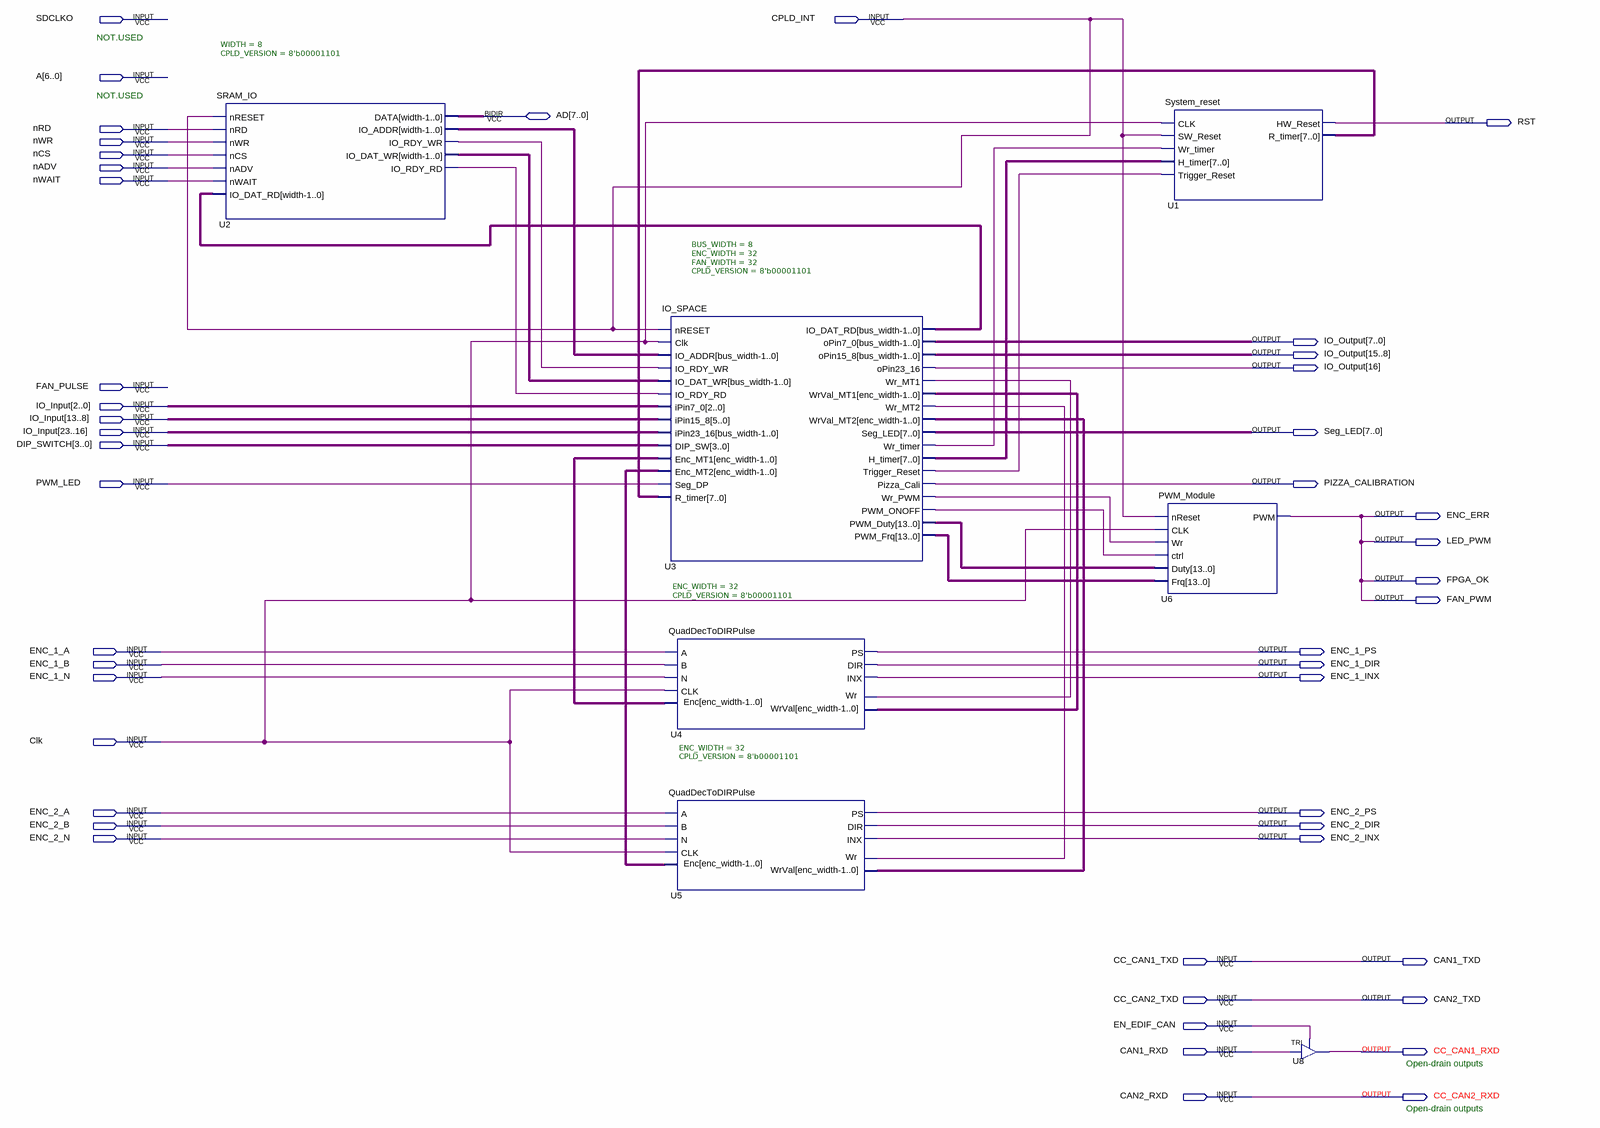
[diagram p0: schematic sheet]
// Quartus schematic MaterialTowerCPLD.bdf as structural Verilog: 7 symbols, 47 pins
module MaterialTowerCPLD (
  input  SDCLKO,
  input  CPLD_INT,
  input  [6:0] A,
  input  nRD,
  input  nWR,
  input  nCS,
  input  nADV,
  input  nWAIT,
  input  FAN_PULSE,
  input  [23:0] IO_Input,
  input  [3:0] DIP_SWITCH,
  input  PWM_LED,
  input  ENC_1_A,
  input  ENC_1_B,
  input  ENC_1_N,
  input  Clk,
  input  ENC_2_A,
  input  ENC_2_B,
  input  ENC_2_N,
  input  CC_CAN1_TXD,
  input  CC_CAN2_TXD,
  input  EN_EDIF_CAN,
  input  CAN1_RXD,
  input  CAN2_RXD,
  inout  [7:0] AD,
  output RST,
  output [16:0] IO_Output,
  output [7:0] Seg_LED,
  output PIZZA_CALIBRATION,
  output ENC_ERR,
  output LED_PWM,
  output FPGA_OK,
  output FAN_PWM,
  output ENC_1_PS,
  output ENC_1_DIR,
  output ENC_1_INX,
  output ENC_2_PS,
  output ENC_2_DIR,
  output ENC_2_INX,
  output CAN1_TXD,
  output CAN2_TXD,
  output CC_CAN1_RXD,
  output CC_CAN2_RXD
);

  wire U2_io_rdy_rd, U2_io_rdy_wr, U3_pwm_onoff, U3_trigger_reset, U3_wr_mt1, U3_wr_mt2, U3_wr_pwm,
       U3_wr_timer;
  wire [7:0] U1_r_timer, U2_io_addr, U2_io_dat_wr, U3_h_timer, U3_io_dat_rd;
  wire [13:0] U3_pwm_duty, U3_pwm_frq;
  wire [31:0] U3_wrval_mt1, U3_wrval_mt2, U4_enc, U5_enc;

  SRAM_IO #(.WIDTH(8), .CPLD_VERSION(8'b00001101)) U2 (
    .nRESET(CPLD_INT), .nRD(nRD), .nWR(nWR), .nCS(nCS), .nADV(nADV), .nWAIT(nWAIT), .IO_DAT_RD(U3_io_dat_rd),
    .IO_ADDR(U2_io_addr), .IO_RDY_WR(U2_io_rdy_wr), .IO_DAT_WR(U2_io_dat_wr), .IO_RDY_RD(U2_io_rdy_rd),
    .DATA(AD));
  IO_SPACE #(.BUS_WIDTH(8), .ENC_WIDTH(32), .FAN_WIDTH(32), .CPLD_VERSION(8'b00001101)) U3 (
    .nRESET(CPLD_INT), .Clk(Clk), .IO_ADDR(U2_io_addr), .IO_RDY_WR(U2_io_rdy_wr), .IO_DAT_WR(U2_io_dat_wr),
    .IO_RDY_RD(U2_io_rdy_rd), .iPin7_0(IO_Input[2:0]), .iPin15_8(IO_Input[13:8]),
    .iPin23_16(IO_Input[23:16]), .DIP_SW(DIP_SWITCH), .Enc_MT1(U4_enc), .Enc_MT2(U5_enc), .Seg_DP(PWM_LED),
    .R_timer(U1_r_timer), .IO_DAT_RD(U3_io_dat_rd), .oPin7_0(IO_Output[7:0]), .oPin15_8(IO_Output[15:8]),
    .oPin23_16(IO_Output[16]), .Wr_MT1(U3_wr_mt1), .WrVal_MT1(U3_wrval_mt1), .Wr_MT2(U3_wr_mt2),
    .WrVal_MT2(U3_wrval_mt2), .Seg_LED(Seg_LED), .Wr_timer(U3_wr_timer), .H_timer(U3_h_timer),
    .Trigger_Reset(U3_trigger_reset), .Pizza_Cali(PIZZA_CALIBRATION), .Wr_PWM(U3_wr_pwm),
    .PWM_ONOFF(U3_pwm_onoff), .PWM_Duty(U3_pwm_duty), .PWM_Frq(U3_pwm_frq));
  QuadDecToDIRPulse #(.ENC_WIDTH(32), .CPLD_VERSION(8'b00001101)) U4 (
    .A(ENC_1_A), .B(ENC_1_B), .N(ENC_1_N), .CLK(Clk), .Wr(U3_wr_mt1), .WrVal(U3_wrval_mt1), .PS(ENC_1_PS),
    .DIR(ENC_1_DIR), .INX(ENC_1_INX), .Enc(U4_enc));
  QuadDecToDIRPulse #(.ENC_WIDTH(32), .CPLD_VERSION(8'b00001101)) U5 (
    .A(ENC_2_A), .B(ENC_2_B), .N(ENC_2_N), .CLK(Clk), .Wr(U3_wr_mt2), .WrVal(U3_wrval_mt2), .PS(ENC_2_PS),
    .DIR(ENC_2_DIR), .INX(ENC_2_INX), .Enc(U5_enc));
  System_reset U1 (
    .CLK(Clk), .SW_Reset(CPLD_INT), .Wr_timer(U3_wr_timer), .H_timer(U3_h_timer),
    .Trigger_Reset(U3_trigger_reset), .HW_Reset(RST), .R_timer(U1_r_timer));
  PWM_Module U6 (
    .nReset(CPLD_INT), .CLK(Clk), .Wr(U3_wr_pwm), .ctrl(U3_pwm_onoff), .Duty(U3_pwm_duty), .Frq(U3_pwm_frq),
    .PWM(ENC_ERR));
  TRI U8 (.IN(CAN1_RXD), .OE(EN_EDIF_CAN), .OUT(CC_CAN1_RXD));

  assign CAN1_TXD = CC_CAN1_TXD;
  assign CAN2_TXD = CC_CAN2_TXD;
  assign CC_CAN2_RXD = CAN2_RXD;
  assign FAN_PWM = ENC_ERR;
  assign FPGA_OK = ENC_ERR;
  assign LED_PWM = ENC_ERR;

  // Notes on the sheet:
  //   NOT.USED
  //   NOT.USED
  //   Open-drain outputs
  //   Open-drain outputs
endmodule
